# EAGLE design ecg-schematic (EAGLE 9.1.3)
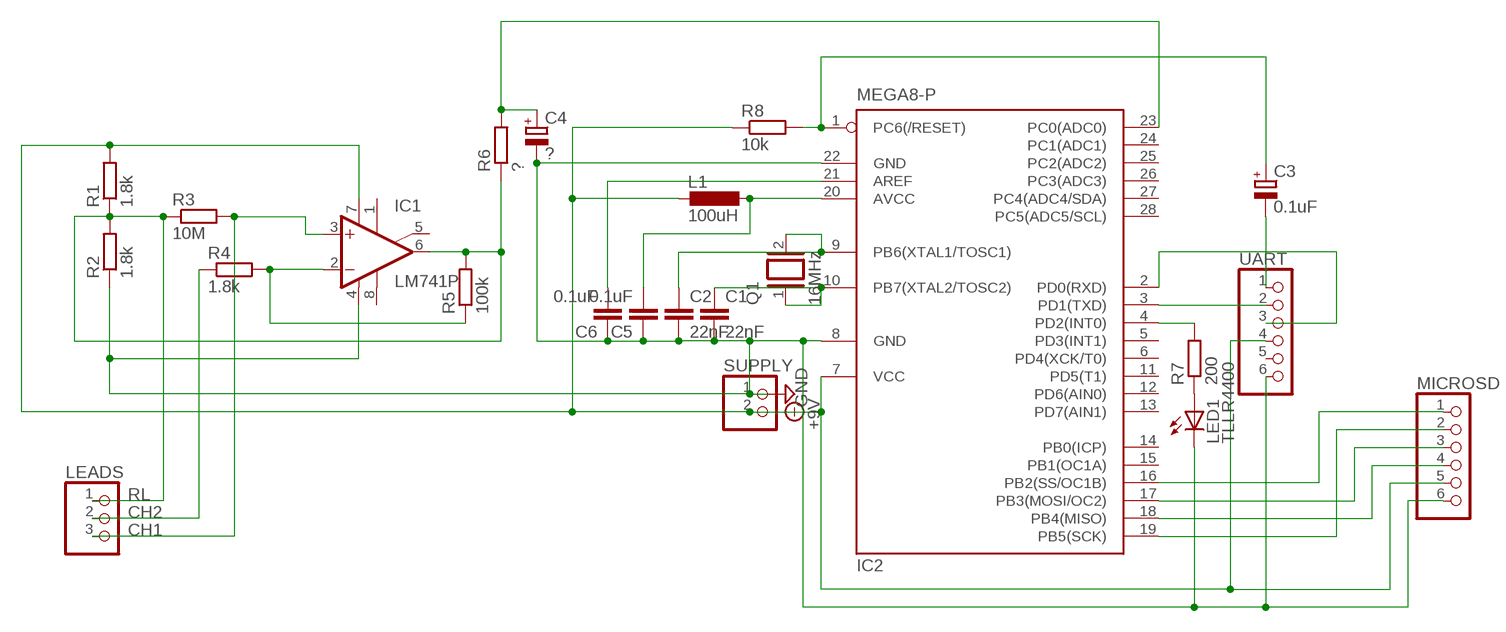
[diagram p0: schematic, sheet 1]

## Parts
C1  22nF  C-EU025-025X050  [C025-025X050]
C2  22nF  C-EU025-025X050  [C025-025X050]
C3  0.1uF  CPOL-EUB45181A  [B45181A]
C4  ?  CPOL-EUETR1  [ETR1]
C5  0.1uF  C-EU025-025X050  [C025-025X050]
C6  0.1uF  C-EU025-025X050  [C025-025X050]
IC1  LM741P  [DIL08]
IC2  MEGA8-P  [DIL28-3]
L1  100uH  L-EU0204/5  [0204/5]
LEADS  PINHD-1X3  [1X03]
LED1  TLLR4400  [LED3MM]
MICROSD  PINHD-1X6  [1X06]
Q1  16MHz  XTAL/S  [QS]
R1  1.8k  R-EU_0204/7  [0204/7]
R2  1.8k  R-EU_0204/7  [0204/7]
R3  10M  R-EU_0204/7  [0204/7]
R4  1.8k  R-EU_0204/7  [0204/7]
R5  100k  R-EU_0204/7  [0204/7]
R6  ?  R-EU_0204/7  [0204/7]
R7  200  R-EU_0204/7  [0204/7]
R8  10k  R-EU_0204/7  [0204/7]
SUPPLY  PINHD-1X2  [1X02]
UART  PINHD-1X6  [1X06]

## Nets
+9V: IC1.7(V+) IC2.7(VCC) L1.2 MICROSD.5 R1.2 R8.1 SUPPLY.2 UART.4
CH1: IC1.3(+IN) LEADS.3 R3.2
CH2: LEADS.2 R4.1
GND: C1.2 C2.2 C4.- C5.1 C6.1 IC1.4(V-) IC2.8(GND) IC2.22(GND) LED1.K(C) MICROSD.6 R2.1 SUPPLY.1 UART.6
N$1: C2.1 IC2.9(PB6(XTAL1/TOSC1)) Q1.2
N$2: C1.1 IC2.10(PB7(XTAL2/TOSC2)) Q1.1
N$3: IC1.2(-IN) R4.2 R5.1
N$4: C3.- UART.1
N$5: C3.+ IC2.1(PC6(/RESET)) R8.2
N$6: IC2.3(PD1(TXD)) UART.2
N$7: IC2.2(PD0(RXD)) UART.3
N$8: C4.+ IC2.23(PC0(ADC0)) R6.2
N$9: IC2.16(PB2(SS/OC1B)) MICROSD.1
N$10: IC2.19(PB5(SCK)) MICROSD.2
N$11: IC2.17(PB3(MOSI/OC2)) MICROSD.3
N$12: IC2.18(PB4(MISO)) MICROSD.4
N$13: LED1.A R7.1
N$14: IC2.4(PD2(INT0)) R7.2
N$15: C5.2 IC2.20(AVCC) L1.1
N$16: C6.2 IC2.21(AREF)
RL: IC1.6(OUT) LEADS.1 R1.1 R2.2 R3.1 R5.2 R6.1
Unconnected: IC1.1(ON1) IC1.5(ON2) IC1.8(OPT) IC2.5(PD3(INT1)) IC2.6(PD4(XCK/T0)) IC2.11(PD5(T1)) IC2.12(PD6(AIN0)) IC2.13(PD7(AIN1)) IC2.14(PB0(ICP)) IC2.15(PB1(OC1A)) IC2.24(PC1(ADC1)) IC2.25(PC2(ADC2)) IC2.26(PC3(ADC3)) IC2.27(PC4(ADC4/SDA)) IC2.28(PC5(ADC5/SCL)) UART.5

## Library data of the parts
C1 C2 C5 C6 = rcl:C-EU: CAPACITOR, European symbol; SPICEPREFIX: C
C3 C4 = rcl:CPOL-EU: POLARIZED CAPACITOR, European symbol; SPICEPREFIX: C
IC1 = linear:*741: OP AMP
IC2 = atmel:MEGA8-P: MICROCONTROLLER 8 Kbytes FLASH, 1 kbytes SRAM, 512 bytes EEPROM, USART, 4-channel 10 bit ADC, 2-channel 8 bit ADC Pin compatible with Atmega48, ATMega88, ATMega168 Source: avr.lbr; OC_FARNELL: unknown; OC_NEWARK: unknown
L1 = rcl:L-EU: INDUCTOR, European symbol; SPICEPREFIX: L
LEADS = pinhead:PINHD-1X3: PIN HEADER
LED1 = led:TLLR4400: Low Current (2mA) LED 3 mm Tinted Diffused Package color RED Source: Data sheet <http://www.farnell.com/datasheets/391100.pdf>; MF: VISHAY SEMICONDUCTOR; OC_FARNELL: 1612437
MICROSD UART = pinhead:PINHD-1X6: PIN HEADER
Q1 = special:XTAL/S: CRYSTAL
R1-R8 = rcl:R-EU_: RESISTOR, European symbol; SPICEPREFIX: R
SUPPLY = pinhead:PINHD-1X2: PIN HEADER

## Board
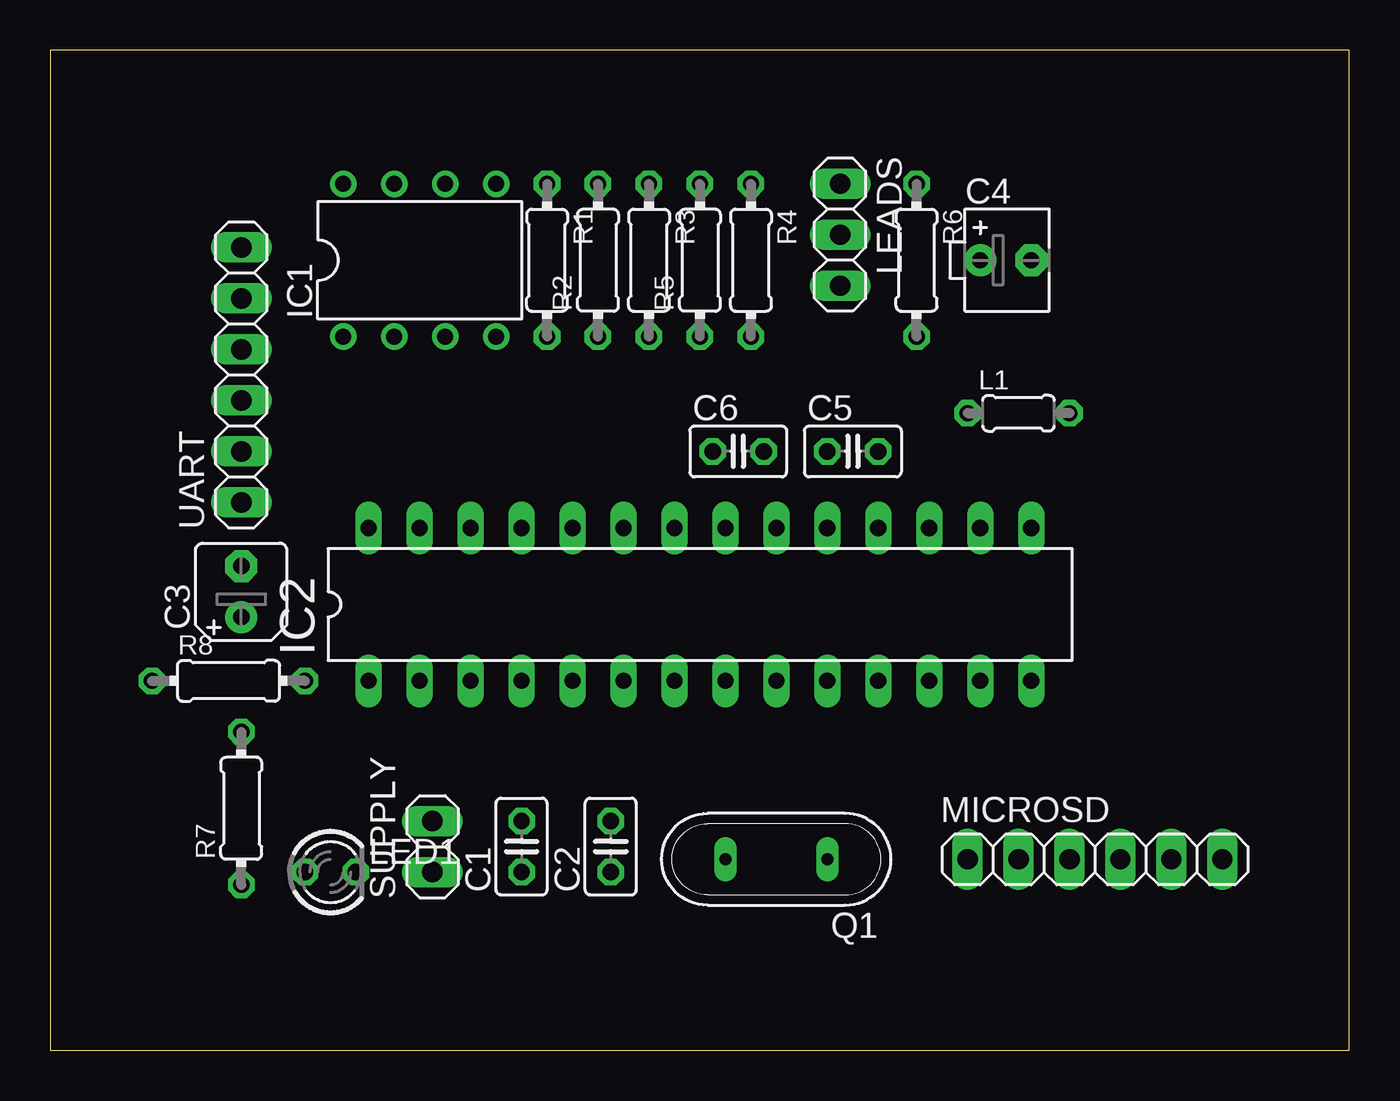
[diagram p1: board, top side]
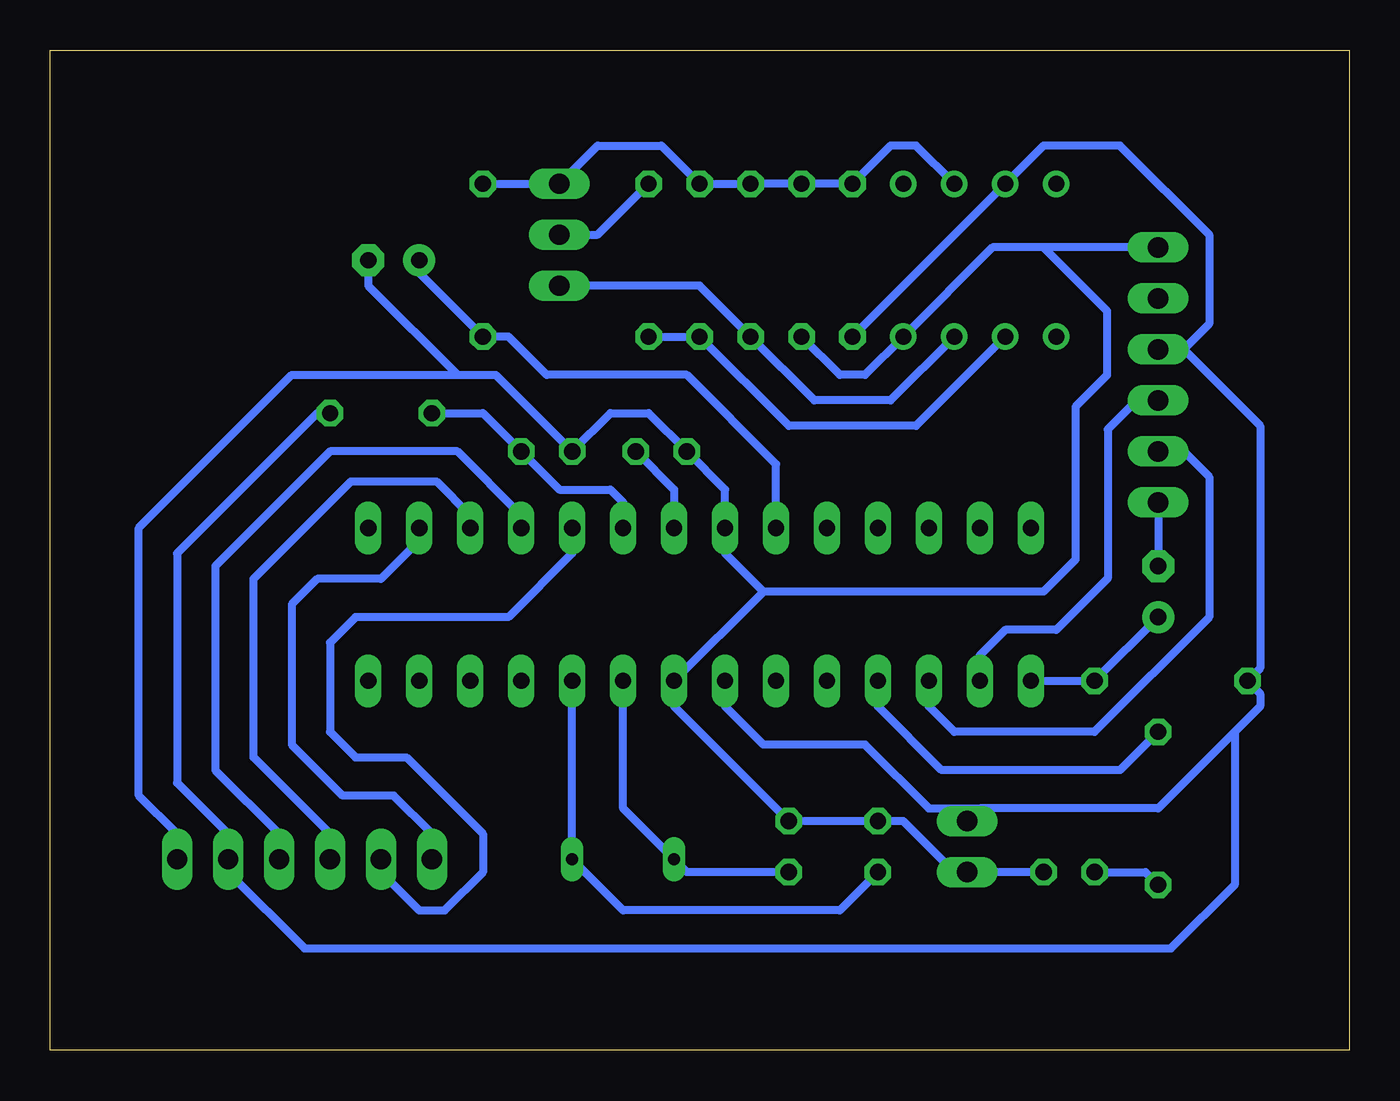
[diagram p2: board, bottom side, seen from below]

Size 64.75 x 49.84 mm. Coordinates in mm from the lower left corner, seen from the top.
Outline: 0,0 64.75,0 64.75,49.84 0,49.84 0,0
Copper layers (1*16): Top 0.035mm / dielectric 1.5mm / Bottom 0.035mm
Design rules "default": minimum track width 6mil, minimum drill 0.35mm, track to track 6mil, track to pad 6mil, pad to pad 6mil, via to via 6mil, smd to smd 6mil, copper to edge 40mil, drill to drill 6mil, minimum pad ring 10mil, minimum via ring 8mil, stop-mask expansion 4mil, vias tented up to drill 0mil, thermal gap 10mil

### Footprints (pad centres in the part's own frame; a part is rotated, then mirrored left to right if it is on the bottom)
C025-025X050 = drill 0.813 octagon: 1 -1.27,0; 2 1.27,0
B45181A = drill 0.813 pad 1.6: + -1.27,0 | drill 0.813 pad 1.6 octagon: - 1.27,0
ETR1 = drill 0.813 pad 1.6: + -1.27,0 | drill 0.813 pad 1.6 octagon: - 1.27,0
DIL08 = drill 0.813 pad 1.27: 1 -3.81,-3.81; 2 -1.27,-3.81; 3 1.27,-3.81; 4 3.81,-3.81; 5 3.81,3.81; 6 1.27,3.81; 7 -1.27,3.81; 8 -3.81,3.81
DIL28-3 = drill 0.813 long: 1 -16.51,-3.81; 2 -13.97,-3.81; 3 -11.43,-3.81; 4 -8.89,-3.81; 5 -6.35,-3.81; 6 -3.81,-3.81; 7 -1.27,-3.81; 8 1.27,-3.81; 9 3.81,-3.81; 10 6.35,-3.81; 11 8.89,-3.81; 12 11.43,-3.81; 13 13.97,-3.81; 14 16.51,-3.81; 15 16.51,3.81; 16 13.97,3.81; 17 11.43,3.81; 18 8.89,3.81; 19 6.35,3.81; 20 3.81,3.81; 21 1.27,3.81; 22 -1.27,3.81; 23 -3.81,3.81; 24 -6.35,3.81; 25 -8.89,3.81; 26 -11.43,3.81; 27 -13.97,3.81; 28 -16.51,3.81
0204/5 = drill 0.813 octagon: 1 -2.54,0; 2 2.54,0
1X03 = drill 1.016 long: 1 -2.54,0; 2 0,0; 3 2.54,0
LED3MM = drill 0.813 octagon: A -1.27,0; K 1.27,0
1X06 = drill 1.016 long: 1 -6.35,0; 2 -3.81,0; 3 -1.27,0; 4 1.27,0; 5 3.81,0; 6 6.35,0
QS = drill 0.61 long: 1 -2.54,0; 2 2.54,0
0204/7 = drill 0.813 octagon: 1 -3.81,0; 2 3.81,0
1X02 = drill 1.016 long: 1 -1.27,0; 2 1.27,0

### Placement (x,y rotation side)
C1  23.49,10.16 90 top
C2  27.94,10.16 90 top
C3  9.52,22.86 90 top
C4  47.63,39.37 0 top
C5  40.01,29.84 0 top
C6  34.29,29.84 0 top
IC1  18.41,39.37 0 top
IC2  32.38,22.23 0 top
L1  48.26,31.75 0 top
LEADS  39.37,40.64 270 top
LED1  13.97,8.89 0 top
MICROSD  52.07,9.53 0 top
Q1  36.2,9.53 180 top
R1  24.76,39.37 270 top
R2  27.3,39.37 90 top
R3  29.85,39.37 270 top
R4  34.93,39.37 270 top
R5  32.38,39.37 90 top
R6  43.18,39.37 270 top
R7  9.52,12.06 90 top
R8  8.89,18.41 0 top
SUPPLY  19.05,10.16 90 top
UART  9.52,33.66 90 top

### Tracks (layer width: path | path; a pad name or v marks a point on that pad's centre or on a via)
+9V
  Bottom 0.406: R1.2 IC1.7 15.24,45.09 11.43,45.09 6.99,40.64 6.99,36.2 8.26,34.92 | IC2.7 31.12,17.15 29.21,15.24 24.13,15.24 20.96,12.06 19.68,12.06 | 5.71,15.88 5.71,8.26 8.89,5.08 52.07,5.08 55.88,8.89 MICROSD.5 55.88,10.79 58.42,13.33 58.42,24.77 51.43,31.75 L1.2 | 18.41,12.06 SUPPLY.2 19.68,12.06 | 18.41,12.06 9.52,12.06 5.71,15.88 | UART.4 8.26,34.92 | 8.26,34.92 4.45,31.11 4.45,19.05 R8.1 4.45,17.78 4.45,17.15 5.71,15.88 | 19.68,12.06 18.41,12.06
CH1
  Bottom 0.406: LEADS.3 32.38,38.1 R3.2 26.67,32.38 22.86,32.38 IC1.3
CH2
  Bottom 0.406: LEADS.2 37.46,40.64 R4.1
GND
  Bottom 0.406: 29.21,22.86 15.24,22.86 13.65,24.45 13.65,32.07 12.07,33.66 12.07,36.83 15.24,40 | 29.21,22.86 31.12,24.77 IC2.22 31.12,27.94 C6.1 34.93,31.75 36.83,31.75 C5.1 42.54,33.66 44.45,33.66 | 29.21,22.86 IC2.8 33.65,17.15 C2.2 C1.2 22.23,11.43 19.68,8.89 SUPPLY.1 LED1.K | 44.45,33.66 52.71,33.66 60.32,26.03 60.32,12.7 58.42,10.79 MICROSD.6 | R2.1 25.4,33.66 24.13,33.66 IC1.4 17.78,40 15.24,40 | UART.6 15.24,40 | C4.- 48.9,38.1 44.45,33.66
N$1
  Bottom 0.406: C2.1 33.02,8.89 Q1.2 36.2,12.06 IC2.9
N$2
  Bottom 0.406: C1.1 25.4,6.99 36.2,6.99 Q1.1 IC2.10
N$3
  Bottom 0.406: R4.2 R5.1 27.94,31.11 21.59,31.11 17.78,34.92 IC1.2
N$4
  Bottom 0.406: UART.1 C3.-
N$5
  Bottom 0.406: C3.+ R8.2 IC2.1
N$6
  Bottom 0.406: UART.2 8.26,29.84 6.99,28.57 6.99,21.59 12.7,15.88 19.68,15.88 20.96,17.15 IC2.3
N$7
  Bottom 0.406: IC2.2 18.41,19.69 17.15,20.95 14.6,20.95 12.04,23.52 12.04,30.94 10.6,32.38 UART.3
N$8
  Bottom 0.406: IC2.23 28.57,29.21 33.02,33.66 40.01,33.66 41.91,35.56 R6.2 46.35,38.73 C4.+
N$9
  Bottom 0.406: MICROSD.1 45.72,10.79 47.63,12.7 50.16,12.7 52.71,15.24 52.71,22.23 51.43,23.49 48.26,23.49 46.35,25.4 IC2.16
N$10
  Bottom 0.406: MICROSD.2 48.26,8.89 46.35,6.99 45.09,6.99 43.18,8.89 43.18,10.79 46.99,14.6 49.53,14.6 50.8,15.88 50.8,20.32 49.53,21.59 41.91,21.59 38.74,24.77 IC2.19
N$11
  Bottom 0.406: MICROSD.3 50.8,10.79 54.61,14.6 54.61,23.49 49.76,28.35 45.49,28.35 43.82,26.67 IC2.17
N$12
  Bottom 0.406: MICROSD.4 53.34,10.79 56.51,13.97 56.51,24.13 50.8,29.84 44.45,29.84 41.27,26.67 IC2.18
N$13
  Bottom 0.406: LED1.A 10.16,8.89 R7.1
N$14
  Bottom 0.406: IC2.4 23.49,17.15 20.32,13.97 11.43,13.97 R7.2
N$15
  Bottom 0.406: IC2.20 36.2,27.3 36.83,27.94 39.37,27.94 C5.2 43.18,31.75 L1.1
N$16
  Bottom 0.406: C6.2 33.65,27.94 IC2.21
RL
  Bottom 0.406: IC1.6 21.59,45.09 22.86,45.09 R1.1 R2.2 R3.1 R5.2 34.29,45.09 37.46,45.09 LEADS.1 R6.1